# EAGLE design sampling (EAGLE 9.6.1)
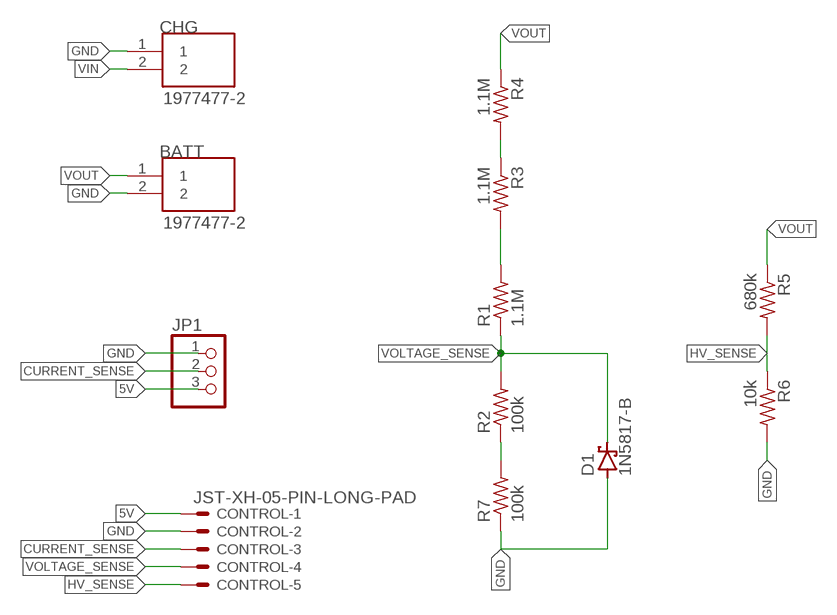
[diagram p0: schematic, sheet 1]

## Parts
BATT  1977477-2  [TE_1977477-2]
CHG  1977477-2  [TE_1977477-2]
CONTROL  JST-XH-05-PIN-LONG-PAD  [JST-XH-05-PACKAGE-LONG-PAD]
D1  1N5817-B  [DO41-7.6]
JP1  PINHD-1X3  [1X03]
R1  1.1M  R-US_R0805  [R0805]
R2  100k  R-US_R0805  [R0805]
R3  1.1M  R-US_R0805  [R0805]
R4  1.1M  R-US_R0805  [R0805]
R5  680k  R-US_0207/10  [0207/10]
R6  10k  R-US_0207/10  [0207/10]
R7  100k  R-US_R0805  [R0805]

## Nets
5V: CONTROL.1 JP1.3
CURRENT_SENSE: CONTROL.3 JP1.2
GND: BATT.2 CHG.1 CONTROL.2 D1.A JP1.1 R6.2 R7.1
HV_SENSE: CONTROL.5 R5.2 R6.1
N$1: R1.2 R3.2
N$2: R3.1 R4.2
N$3: R2.1 R7.2
VIN: CHG.2
VOLTAGE_SENSE: CONTROL.4 D1.C R1.1 R2.2
VOUT: BATT.1 R4.1 R5.1

## Library data of the parts
BATT CHG = terminal_block_TA:1977477-2: Check availability <https://pricing.snapeda.com/parts/1977477-2/TE%20Connectivity/view-part?ref=eda>; AVAILABILITY: In Stock; COMMENT: 1977477-2; DESCRIPTION: Conn Barrier Strip 2 POS 8.25mm Solder ST Thru-Hole 15A/Contact Carton; MF: TE Connectivity; MP: 1977477-2; PACKAGE: None; PRICE: None; PURCHASE-URL: https://pricing.snapeda.com/search/part/1977477-2/?ref=eda
CONTROL = Rembrandt Electronics - JST XH Connectors v1-0:JST-XH-05-PIN: JST XH Connector 2 Pin Wire to board connector. Pitch: 2,54 mm, (0.100") Number of pins: 5 Created by Rembrandt Electronics www.rembrandtelectronics.com
D1 = diode:1N581*: 1.0A SCHOTTKY BARRIER RECTIFIER Source: http://www.diodes.com/datasheets/ds23001.pdf
JP1 = pinhead:PINHD-1X3: PIN HEADER
R1-R7 = rcl:R-US_: RESISTOR, American symbol; SPICEPREFIX: R

## Board
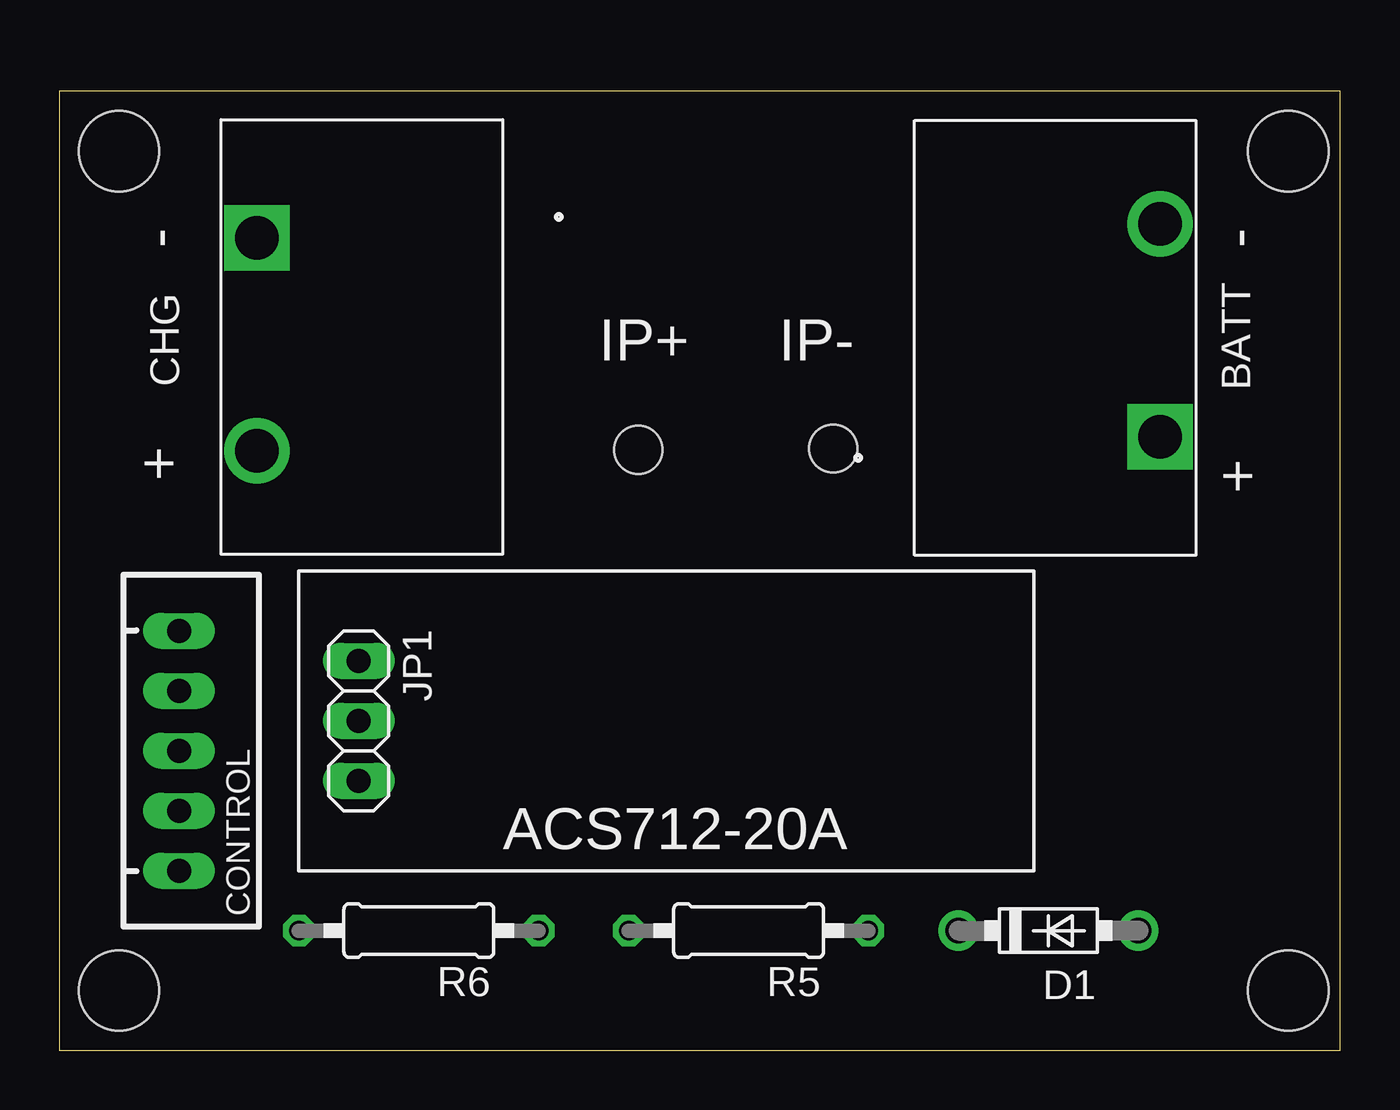
[diagram p1: board, top side]
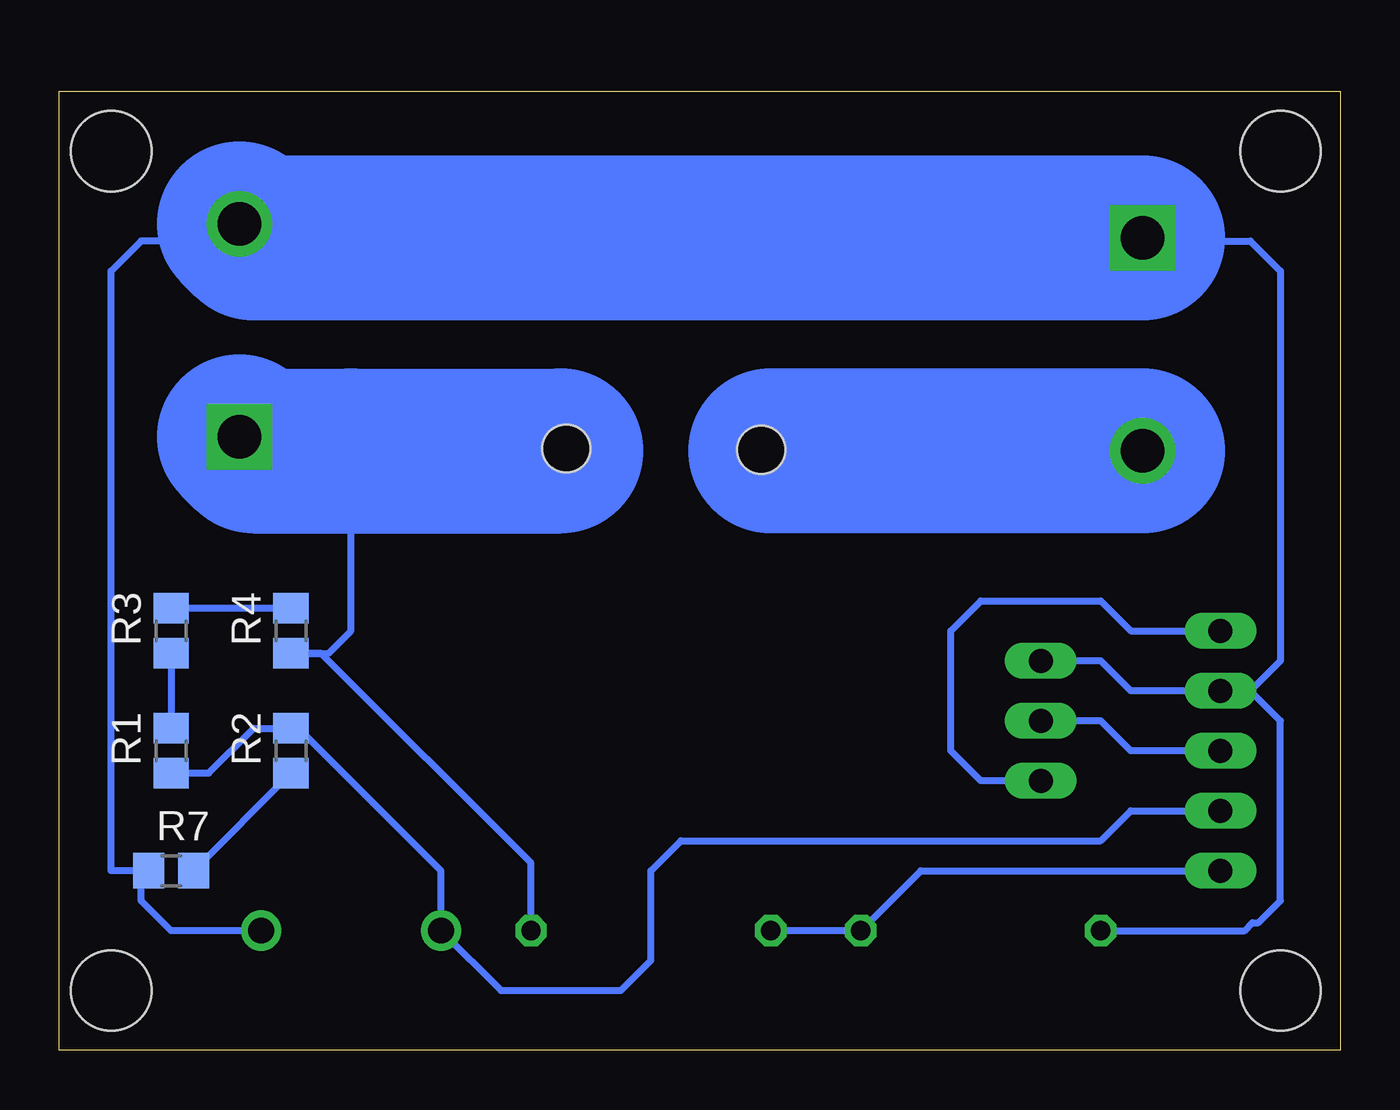
[diagram p2: board, bottom side, seen from below]

Size 54.28 x 40.63 mm. Coordinates in mm from the lower left corner, seen from the top.
Outline: 0,0 54.28,0 54.28,40.63 0,40.63 0,0
Copper layers (1*16): Top 0.035mm / dielectric 1.5mm / Bottom 0.035mm
Design rules "default *": minimum track width 12mil, minimum drill 0.35mm, track to track 12mil, track to pad 12mil, pad to pad 12mil, via to via 12mil, smd to smd 12mil, copper to edge 40mil, drill to drill 6mil, minimum pad ring 10mil, minimum via ring 8mil, stop-mask expansion 4mil, vias tented up to drill 0mil, thermal gap 10mil
Holes 3.4 mm at 2.54,2.54 52.07,2.54 52.07,38.1 2.54,38.1
Holes 2.03 mm at 24.54,25.45 32.79,25.5

### Footprints (pad centres in the part's own frame; a part is rotated, then mirrored left to right if it is on the bottom)
TE_1977477-2 = drill 1.85 square: 1 -3.241,-5.334 | drill 1.85: 2 5.781,-5.334
JST-XH-05-PACKAGE-LONG-PAD = drill 1.016 long: 1 -5.08,0; 2 -2.54,0; 3 0,0; 4 2.54,0; 5 5.08,0
DO41-7.6 = drill 1.1 pad 1.7: A 3.81,0; C -3.81,0
1X03 = drill 1.016 long: 1 -2.54,0; 2 0,0; 3 2.54,0
R0805 = smd 1.3 x 1.5: 1 -0.95,0; 2 0.95,0
0207/10 = drill 0.813 octagon: 1 -5.08,0; 2 5.08,0

### Placement (x,y rotation side)
BATT  41.31,29.24 90 top
CHG  13.72,31.18 270 top
CONTROL  5.08,12.7 270 top
D1  41.91,5.08 0 top
JP1  12.7,13.97 270 top
R1  49.53,12.7 90 bottom
R2  44.45,12.7 90 bottom
R3  49.53,17.78 270 bottom
R4  44.45,17.78 90 bottom
R5  29.21,5.08 180 top
R6  15.24,5.08 180 top
R7  49.53,7.62 0 bottom

### Tracks (layer width: path | path; a pad name or v marks a point on that pad's centre or on a via)
5V
  Bottom 0.305: JP1.3 15.24,11.43 16.51,12.7 16.51,17.78 15.24,19.05 10.16,19.05 8.89,17.78 CONTROL.1
CURRENT_SENSE
  Bottom 0.305: CONTROL.3 8.89,12.7 10.16,13.97 JP1.2
GND
  Bottom 0.305: JP1.1 10.16,16.51 8.89,15.24 CONTROL.2 3.81,15.24 | CHG.1 8.25,34.29 3.81,34.29 2.54,33.02 2.54,16.51 3.81,15.24 | 3.81,15.24 2.54,13.97 2.54,6.35 3.48,5.41 3.73,5.41 4.06,5.08 R6.2 | BATT.2 47.37,34.29 50.8,34.29 52.07,33.02 52.07,7.62 50.8,7.62 | R7.1 50.8,7.62 | D1.A 49.53,5.08 50.8,6.35 50.8,7.62
  Bottom 6.985: CHG.1 46.05,34.42 BATT.2
HV_SENSE
  Bottom 0.305: R5.2 R6.1 17.78,7.62 CONTROL.5
N$1
  Bottom 0.305: R3.2 R1.2
N$2
  Bottom 0.305: R4.2 R3.1
N$3
  Bottom 0.305: R7.2 R2.1
VIN
  Bottom 6.985: CHG.2 24.13,25.4
VOLTAGE_SENSE
  Bottom 0.305: R1.1 47.94,11.75 46.04,13.65 R2.2 44.13,13.65 38.1,7.62 D1.C 35.56,2.54 30.48,2.54 29.21,3.81 29.21,7.62 27.94,8.89 10.16,8.89 8.89,10.16 CONTROL.4
VOUT
  Bottom 0.305: 45.72,25.07 BATT.1 | 41.91,25.4 41.91,17.78 42.86,16.83 R4.1 43.18,16.83 34.29,7.94 R5.1
  Bottom 6.985: BATT.1 46.05,25.4 41.91,25.4 33.02,25.4

### Text on the board
tPlace: - | - | IP+ | IP- | + | + | ACS712-20A